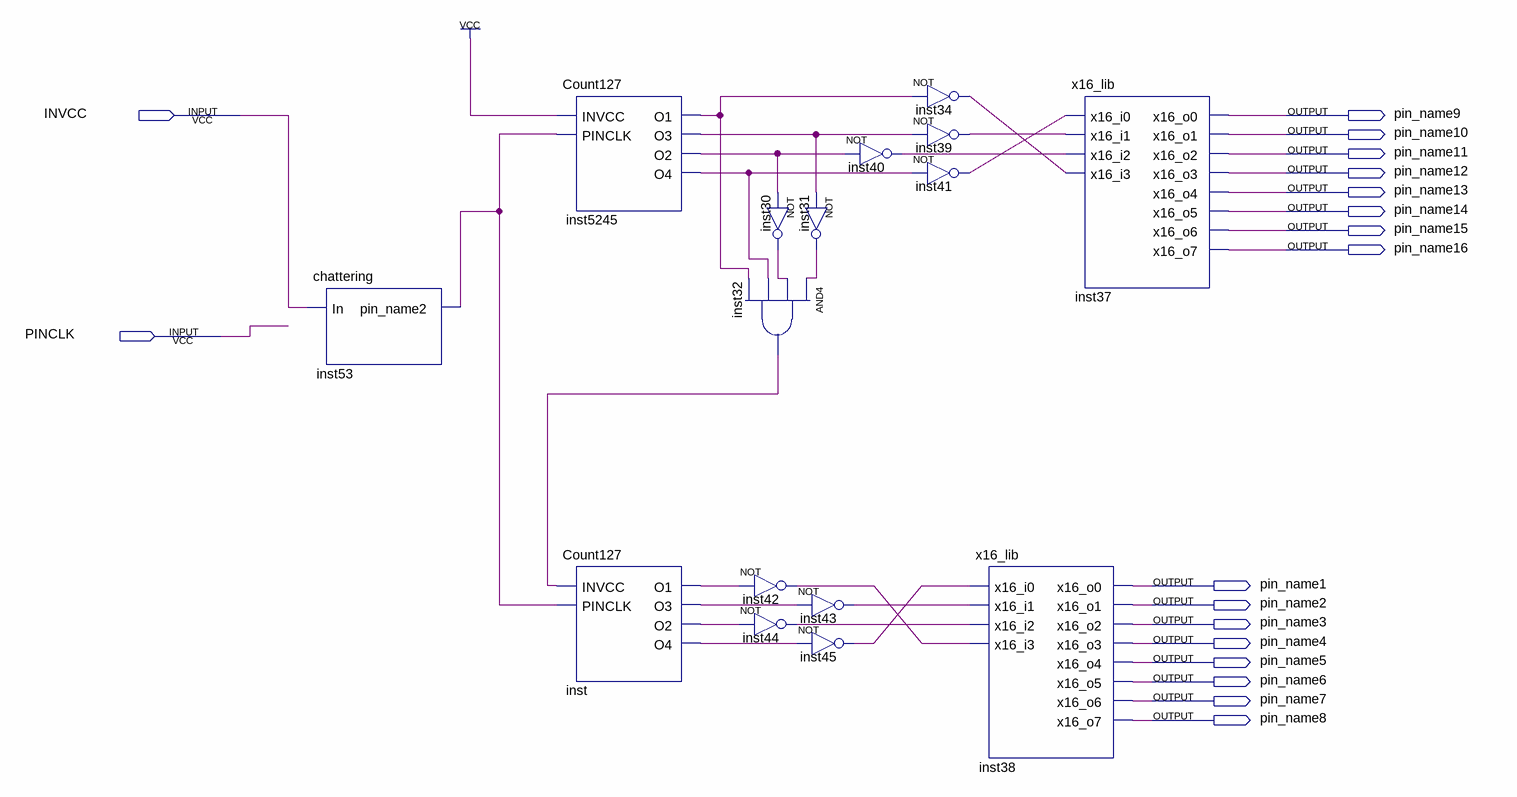
[diagram p0: schematic sheet]
// Quartus schematic x16.bdf as structural Verilog: 16 symbols, 18 pins
module x16 (
  input  INVCC,
  input  PINCLK,
  output pin_name9,
  output pin_name10,
  output pin_name11,
  output pin_name12,
  output pin_name13,
  output pin_name14,
  output pin_name15,
  output pin_name16,
  output pin_name1,
  output pin_name2,
  output pin_name3,
  output pin_name4,
  output pin_name5,
  output pin_name6,
  output pin_name7,
  output pin_name8
);

  wire inst30_out, inst31_out, inst32_out, inst34_out, inst39_out, inst40_out, inst41_out, inst42_out,
       inst43_out, inst44_out, inst45_out, inst53_pin_name2, inst5245_o1, inst5245_o2, inst5245_o3,
       inst5245_o4, inst_o1, inst_o2, inst_o3, inst_o4;

  chattering inst53 (.In(INVCC), .pin_name2(inst53_pin_name2));
  Count127 inst5245 (
    .INVCC(1'b1), .PINCLK(inst53_pin_name2), .O1(inst5245_o1), .O3(inst5245_o3), .O2(inst5245_o2),
    .O4(inst5245_o4));
  Count127 inst (.INVCC(inst32_out), .PINCLK(inst53_pin_name2), .O1(inst_o1), .O3(inst_o3), .O2(inst_o2), .O4(inst_o4));
  not inst30 (inst30_out, inst5245_o2);
  and inst32 (inst32_out, inst31_out, inst30_out, inst5245_o4, inst5245_o1);
  not inst42 (inst42_out, inst_o1);
  not inst44 (inst44_out, inst_o2);
  not inst40 (inst40_out, inst5245_o2);
  not inst31 (inst31_out, inst5245_o3);
  not inst43 (inst43_out, inst_o3);
  not inst45 (inst45_out, inst_o4);
  not inst34 (inst34_out, inst5245_o1);
  not inst39 (inst39_out, inst5245_o3);
  not inst41 (inst41_out, inst5245_o4);
  x16_lib inst38 (
    .x16_i0(inst45_out), .x16_i1(inst43_out), .x16_i2(inst44_out), .x16_i3(inst42_out), .x16_o0(pin_name1),
    .x16_o1(pin_name2), .x16_o2(pin_name3), .x16_o3(pin_name4), .x16_o4(pin_name5), .x16_o5(pin_name6),
    .x16_o6(pin_name7), .x16_o7(pin_name8));
  x16_lib inst37 (
    .x16_i0(inst41_out), .x16_i1(inst39_out), .x16_i2(inst40_out), .x16_i3(inst34_out), .x16_o0(pin_name9),
    .x16_o1(pin_name10), .x16_o2(pin_name11), .x16_o3(pin_name12), .x16_o4(pin_name13), .x16_o5(pin_name14),
    .x16_o6(pin_name15), .x16_o7(pin_name16));
endmodule
